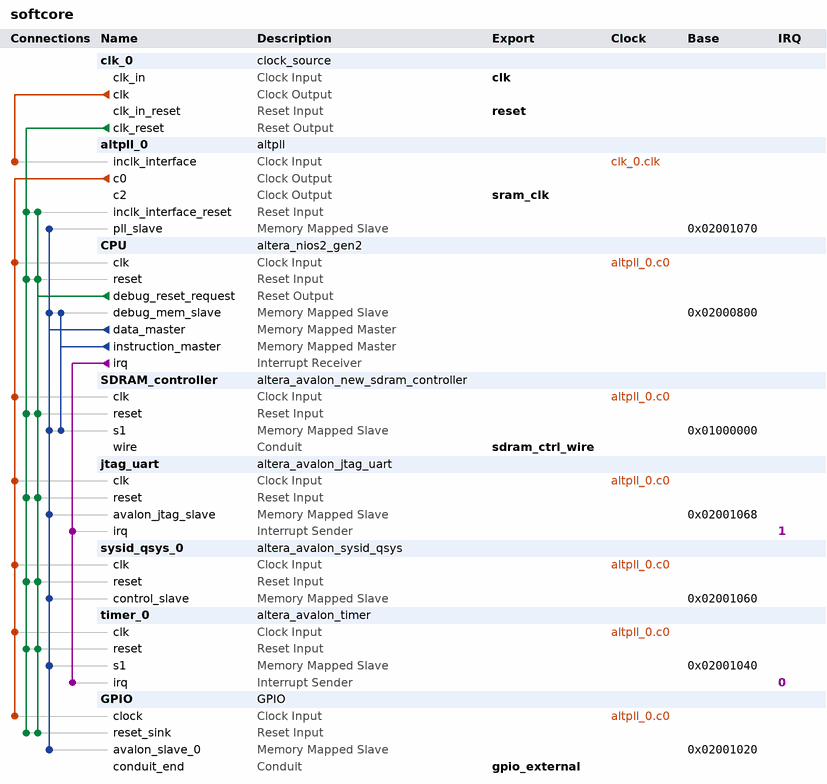
[diagram p0: system contents]
# Platform Designer (Qsys) system softcore, Cyclone IV E EP4CE30F23C7
# Parameters at their usual value, and those the tool derives, are not listed.
package require -exact qsys 18.1
create_system softcore
set_project_property DEVICE_FAMILY {Cyclone IV E}
set_project_property DEVICE EP4CE30F23C7

add_instance clk_0 clock_source 18.1
set_instance_parameter_value clk_0 clockFrequency 50000000

add_instance altpll_0 altpll 18.1
set_instance_parameter_value altpll_0 CLK0_DIVIDE_BY 1
set_instance_parameter_value altpll_0 CLK0_MULTIPLY_BY 1
set_instance_parameter_value altpll_0 CLK2_DIVIDE_BY 1
set_instance_parameter_value altpll_0 CLK2_DUTY_CYCLE 50
set_instance_parameter_value altpll_0 CLK2_MULTIPLY_BY 1
set_instance_parameter_value altpll_0 CLK2_PHASE_SHIFT 0
set_instance_parameter_value altpll_0 INCLK0_INPUT_FREQUENCY 20000
set_instance_parameter_value altpll_0 PORT_ARESET PORT_UNUSED
set_instance_parameter_value altpll_0 PORT_LOCKED PORT_UNUSED
set_instance_parameter_value altpll_0 PORT_clk1 PORT_UNUSED
set_instance_parameter_value altpll_0 PORT_clk2 PORT_USED
set_instance_parameter_value altpll_0 PORT_clk3 PORT_UNUSED

add_instance CPU altera_nios2_gen2 18.1
set_instance_parameter_value CPU dcache_size 2048
set_instance_parameter_value CPU exceptionSlave SDRAM_controller.s1
set_instance_parameter_value CPU icache_size 4096
set_instance_parameter_value CPU impl Fast
set_instance_parameter_value CPU resetSlave SDRAM_controller.s1

add_instance SDRAM_controller altera_avalon_new_sdram_controller 18.1
set_instance_parameter_value SDRAM_controller TAC 5.5
set_instance_parameter_value SDRAM_controller TRCD 20.0
set_instance_parameter_value SDRAM_controller TRP 20.0
set_instance_parameter_value SDRAM_controller casLatency 3
set_instance_parameter_value SDRAM_controller columnWidth 9
set_instance_parameter_value SDRAM_controller dataWidth 16
set_instance_parameter_value SDRAM_controller generateSimulationModel false
set_instance_parameter_value SDRAM_controller model single_Micron_MT48LC4M32B2_7_chip
set_instance_parameter_value SDRAM_controller numberOfBanks 4
set_instance_parameter_value SDRAM_controller numberOfChipSelects 1
set_instance_parameter_value SDRAM_controller powerUpDelay 100.0
set_instance_parameter_value SDRAM_controller refreshPeriod 15.625
set_instance_parameter_value SDRAM_controller rowWidth 12

add_instance jtag_uart altera_avalon_jtag_uart 18.1
set_instance_parameter_value jtag_uart simInteractiveOptions NO_INTERACTIVE_WINDOWS

add_instance sysid_qsys_0 altera_avalon_sysid_qsys 18.1
set_instance_parameter_value sysid_qsys_0 id 0

add_instance timer_0 altera_avalon_timer 18.1
set_instance_parameter_value timer_0 period 10
set_instance_parameter_value timer_0 periodUnits MSEC

add_instance GPIO GPIO 1.1

# connections
add_connection altpll_0.c0 CPU.clk clock
add_connection altpll_0.c0 GPIO.clock clock
add_connection altpll_0.c0 jtag_uart.clk clock
add_connection altpll_0.c0 SDRAM_controller.clk clock
add_connection altpll_0.c0 sysid_qsys_0.clk clock
add_connection altpll_0.c0 timer_0.clk clock
add_connection clk_0.clk altpll_0.inclk_interface clock
add_connection clk_0.clk_reset altpll_0.inclk_interface_reset reset
add_connection clk_0.clk_reset CPU.reset reset
add_connection clk_0.clk_reset GPIO.reset_sink reset
add_connection clk_0.clk_reset jtag_uart.reset reset
add_connection clk_0.clk_reset SDRAM_controller.reset reset
add_connection clk_0.clk_reset sysid_qsys_0.reset reset
add_connection clk_0.clk_reset timer_0.reset reset
add_connection CPU.debug_reset_request altpll_0.inclk_interface_reset reset
add_connection CPU.debug_reset_request CPU.reset reset
add_connection CPU.debug_reset_request GPIO.reset_sink reset
add_connection CPU.debug_reset_request jtag_uart.reset reset
add_connection CPU.debug_reset_request SDRAM_controller.reset reset
add_connection CPU.debug_reset_request sysid_qsys_0.reset reset
add_connection CPU.debug_reset_request timer_0.reset reset
add_connection CPU.data_master altpll_0.pll_slave avalon
set_connection_parameter_value CPU.data_master/altpll_0.pll_slave baseAddress 0x02001070
add_connection CPU.data_master CPU.debug_mem_slave avalon
set_connection_parameter_value CPU.data_master/CPU.debug_mem_slave baseAddress 0x02000800
add_connection CPU.data_master GPIO.avalon_slave_0 avalon
set_connection_parameter_value CPU.data_master/GPIO.avalon_slave_0 baseAddress 0x02001020
add_connection CPU.data_master jtag_uart.avalon_jtag_slave avalon
set_connection_parameter_value CPU.data_master/jtag_uart.avalon_jtag_slave baseAddress 0x02001068
add_connection CPU.data_master SDRAM_controller.s1 avalon
set_connection_parameter_value CPU.data_master/SDRAM_controller.s1 baseAddress 0x01000000
add_connection CPU.data_master sysid_qsys_0.control_slave avalon
set_connection_parameter_value CPU.data_master/sysid_qsys_0.control_slave baseAddress 0x02001060
add_connection CPU.data_master timer_0.s1 avalon
set_connection_parameter_value CPU.data_master/timer_0.s1 baseAddress 0x02001040
add_connection CPU.instruction_master CPU.debug_mem_slave avalon
set_connection_parameter_value CPU.instruction_master/CPU.debug_mem_slave baseAddress 0x02000800
add_connection CPU.instruction_master SDRAM_controller.s1 avalon
set_connection_parameter_value CPU.instruction_master/SDRAM_controller.s1 baseAddress 0x01000000
add_connection CPU.irq jtag_uart.irq interrupt
set_connection_parameter_value CPU.irq/jtag_uart.irq irqNumber 1
add_connection CPU.irq timer_0.irq interrupt
set_connection_parameter_value CPU.irq/timer_0.irq irqNumber 0

# exported interfaces
add_interface clk clock sink
set_interface_property clk EXPORT_OF clk_0.clk_in
add_interface gpio_external conduit end
set_interface_property gpio_external EXPORT_OF GPIO.conduit_end
add_interface reset reset sink
set_interface_property reset EXPORT_OF clk_0.clk_in_reset
add_interface sdram_ctrl_wire conduit end
set_interface_property sdram_ctrl_wire EXPORT_OF SDRAM_controller.wire
add_interface sram_clk clock source
set_interface_property sram_clk EXPORT_OF altpll_0.c2

set_interconnect_requirement {$system} qsys_mm.clockCrossingAdapter HANDSHAKE
set_interconnect_requirement {$system} qsys_mm.enableEccProtection FALSE
set_interconnect_requirement {$system} qsys_mm.insertDefaultSlave FALSE
set_interconnect_requirement {$system} qsys_mm.maxAdditionalLatency 1

save_system softcore.qsys
